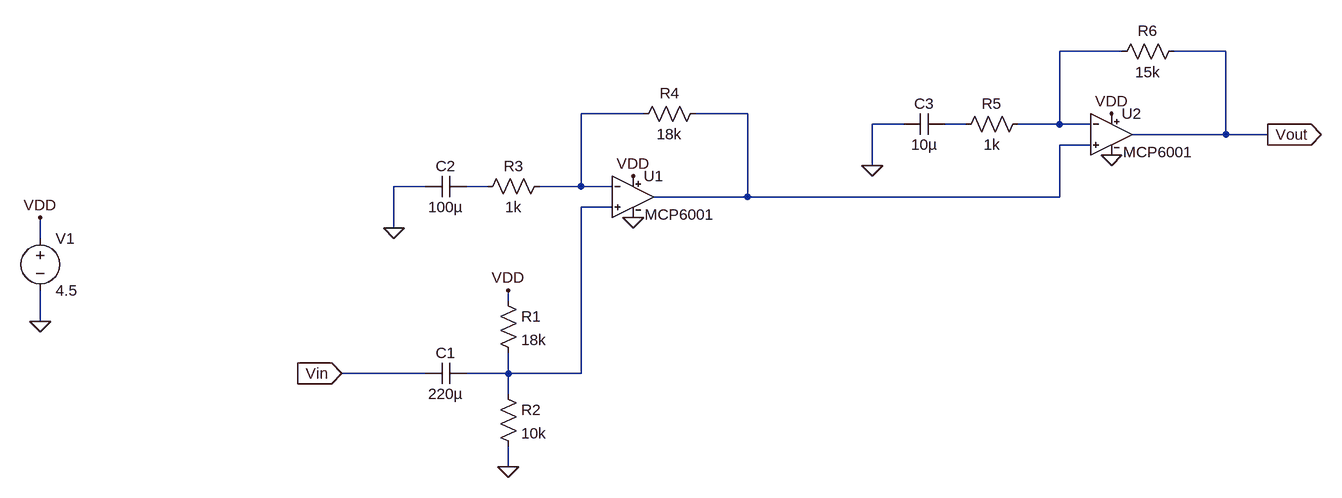
[diagram p0: schematic pre_amp.asc]
pre_amp.asc, the LTspice schematic file:
Version 4
SHEET 1 1456 680
WIRE 1088 -144 992 -144
WIRE 1248 -144 1168 -144
WIRE 352 -48 256 -48
WIRE 512 -48 432 -48
WIRE 752 -32 704 -32
WIRE 848 -32 816 -32
WIRE 992 -32 992 -144
WIRE 992 -32 928 -32
WIRE 1040 -32 992 -32
WIRE 1248 -16 1248 -144
WIRE 1248 -16 1104 -16
WIRE 1312 -16 1248 -16
WIRE 1040 0 992 0
WIRE 704 32 704 -32
WIRE 16 64 -32 64
WIRE 112 64 80 64
WIRE 256 64 256 -48
WIRE 256 64 192 64
WIRE 304 64 256 64
WIRE 512 80 512 -48
WIRE 512 80 368 80
WIRE 992 80 992 0
WIRE 992 80 512 80
WIRE 304 96 256 96
WIRE -32 128 -32 64
WIRE -576 144 -576 112
WIRE 144 240 144 224
WIRE -576 272 -576 224
WIRE 16 352 -112 352
WIRE 144 352 144 320
WIRE 144 352 80 352
WIRE 256 352 256 96
WIRE 256 352 144 352
WIRE 144 384 144 352
WIRE 144 496 144 464
FLAG -32 128 0
FLAG 144 496 0
FLAG 144 224 VDD
FLAG 336 48 VDD
FLAG 336 112 0
FLAG -112 352 Vin
IOPIN -112 352 In
FLAG -576 112 VDD
FLAG -576 272 0
FLAG 704 32 0
FLAG 1072 -48 VDD
FLAG 1072 16 0
FLAG 1312 -16 Vout
IOPIN 1312 -16 Out
SYMBOL res 128 224 R0
SYMATTR InstName R1
SYMATTR Value 18k
SYMBOL res 128 368 R0
SYMATTR InstName R2
SYMATTR Value 10k
SYMBOL cap 80 336 R90
WINDOW 0 0 32 VBottom 2
WINDOW 3 32 32 VTop 2
SYMATTR InstName C1
SYMATTR Value 220µ
SYMBOL res 208 48 R90
WINDOW 0 0 56 VBottom 2
WINDOW 3 32 56 VTop 2
SYMATTR InstName R3
SYMATTR Value 1k
SYMBOL res 448 -64 R90
WINDOW 0 0 56 VBottom 2
WINDOW 3 32 56 VTop 2
SYMATTR InstName R4
SYMATTR Value 18k
SYMBOL cap 80 48 R90
WINDOW 0 0 32 VBottom 2
WINDOW 3 32 32 VTop 2
SYMATTR InstName C2
SYMATTR Value 100µ
SYMBOL voltage -576 128 R0
WINDOW 123 0 0 Left 0
WINDOW 39 0 0 Left 0
SYMATTR InstName V1
SYMATTR Value 4.5
SYMBOL res 944 -48 R90
WINDOW 0 0 56 VBottom 2
WINDOW 3 32 56 VTop 2
SYMATTR InstName R5
SYMATTR Value 1k
SYMBOL res 1184 -160 R90
WINDOW 0 0 56 VBottom 2
WINDOW 3 32 56 VTop 2
SYMATTR InstName R6
SYMATTR Value 15k
SYMBOL cap 816 -48 R90
WINDOW 0 0 32 VBottom 2
WINDOW 3 32 32 VTop 2
SYMATTR InstName C3
SYMATTR Value 10µ
SYMBOL MCP6001_AB 336 16 R0
SYMATTR InstName U1
SYMBOL MCP6001_AB 1072 -80 R0
SYMATTR InstName U2

The netlist it stands for:
* pre_amp.asc
R1 VDD N006 18k
R2 N006 0 10k
C1 N006 Vin 220µ
R3 N002 N005 1k
R4 N003 N002 18k
C2 N005 0 100µ
V1 VDD 0 4.5
R5 N001 N004 1k
R6 Vout N001 15k
C3 N004 0 10µ
XU1 N006 N002 VDD 0 N003 MCP6001  ; pins In+ In- V+ V- OUT
XU2 N003 N001 VDD 0 Vout MCP6001  ; pins In+ In- V+ V- OUT
.lib MCP6001.lib
.backanno
.end